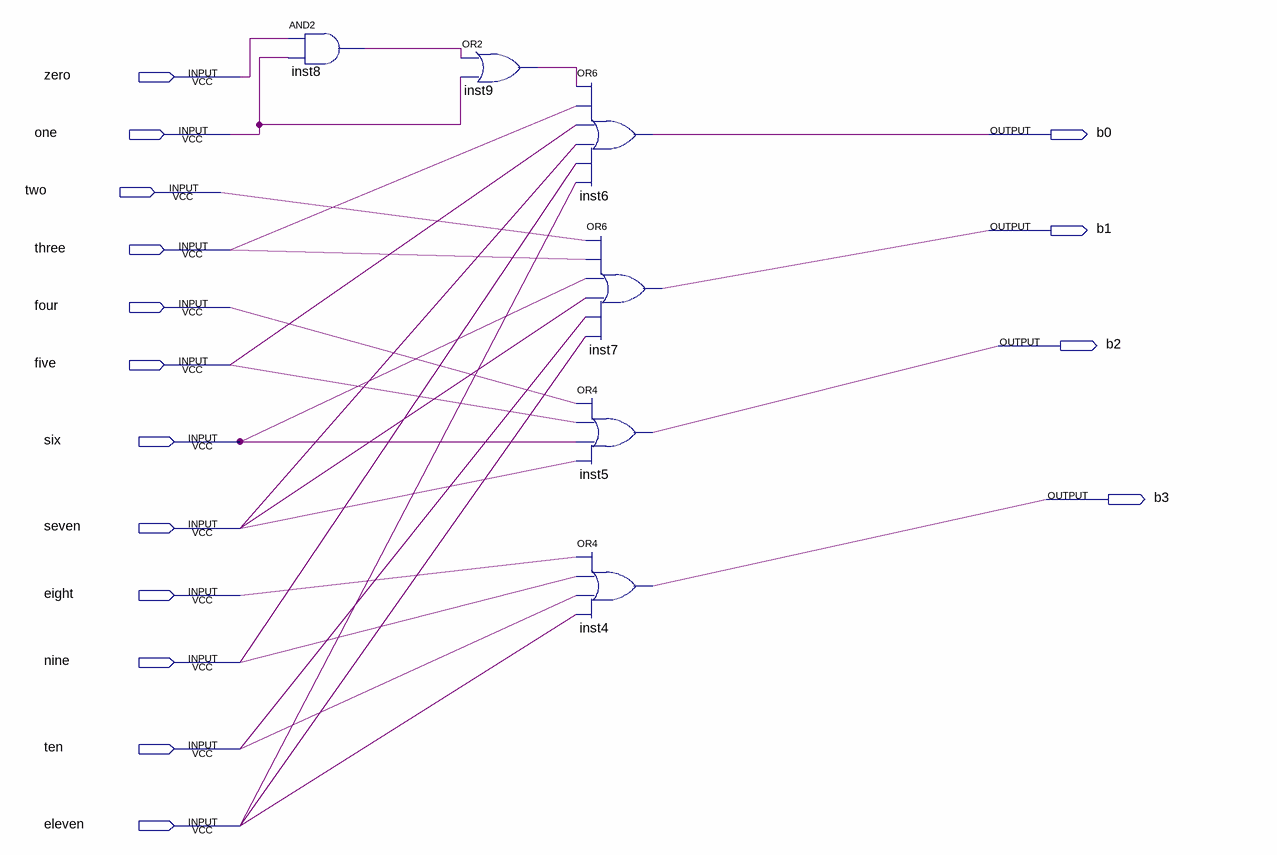
[diagram p0: schematic sheet]
// Quartus schematic chap2_2.bdf as structural Verilog: 6 symbols, 16 pins
module chap2_2 (
  input  zero,
  input  one,
  input  two,
  input  three,
  input  four,
  input  five,
  input  six,
  input  seven,
  input  eight,
  input  nine,
  input  ten,
  input  eleven,
  output b0,
  output b1,
  output b2,
  output b3
);

  wire inst8_out, inst9_out;

  and inst8 (inst8_out, zero, one);
  or inst9 (inst9_out, inst8_out, one);
  or inst6 (b0, inst9_out, three, five, seven, nine, eleven);
  or inst7 (b1, two, three, six, seven, ten, eleven);
  or inst5 (b2, four, five, six, seven);
  or inst4 (b3, eight, nine, ten, eleven);
endmodule
